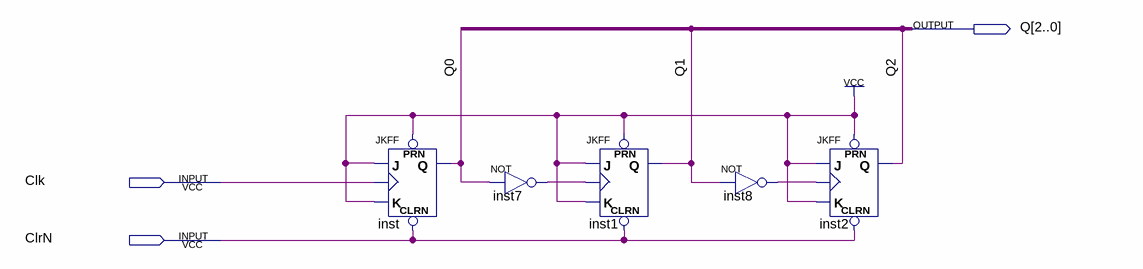
[diagram p0: schematic sheet]
// Quartus schematic 3bitsRipple.bdf as structural Verilog: 5 symbols, 3 pins
module \3bitsRipple  (
  input  Clk,
  input  ClrN,
  output [2:0] Q
);

  wire inst7_out, inst8_out;

  JKFF inst (.PRN(1'b1), .CLRN(ClrN), .K(1'b1), .J(1'b1), .CLK(Clk), .Q(Q[0]));
  not inst7 (inst7_out, Q[0]);
  JKFF inst1 (.PRN(1'b1), .CLRN(ClrN), .K(1'b1), .J(1'b1), .CLK(inst7_out), .Q(Q[1]));
  not inst8 (inst8_out, Q[1]);
  JKFF inst2 (.PRN(1'b1), .CLRN(ClrN), .K(1'b1), .J(1'b1), .CLK(inst8_out), .Q(Q[2]));
endmodule
